# Altium schematic sheet Power_Supply_LV.SchDoc
size A4; CompanyName: Technische Hochschule Nürnberg Georg Simon Ohm; DrawnBy: T Gaupp; Address1: Fürther Straße 250; Address2: 90429 Nürnberg; Address3: GERMANY; SheetNumber: 3; SheetTotal: 6; CompanyName2: Institut ELSYS
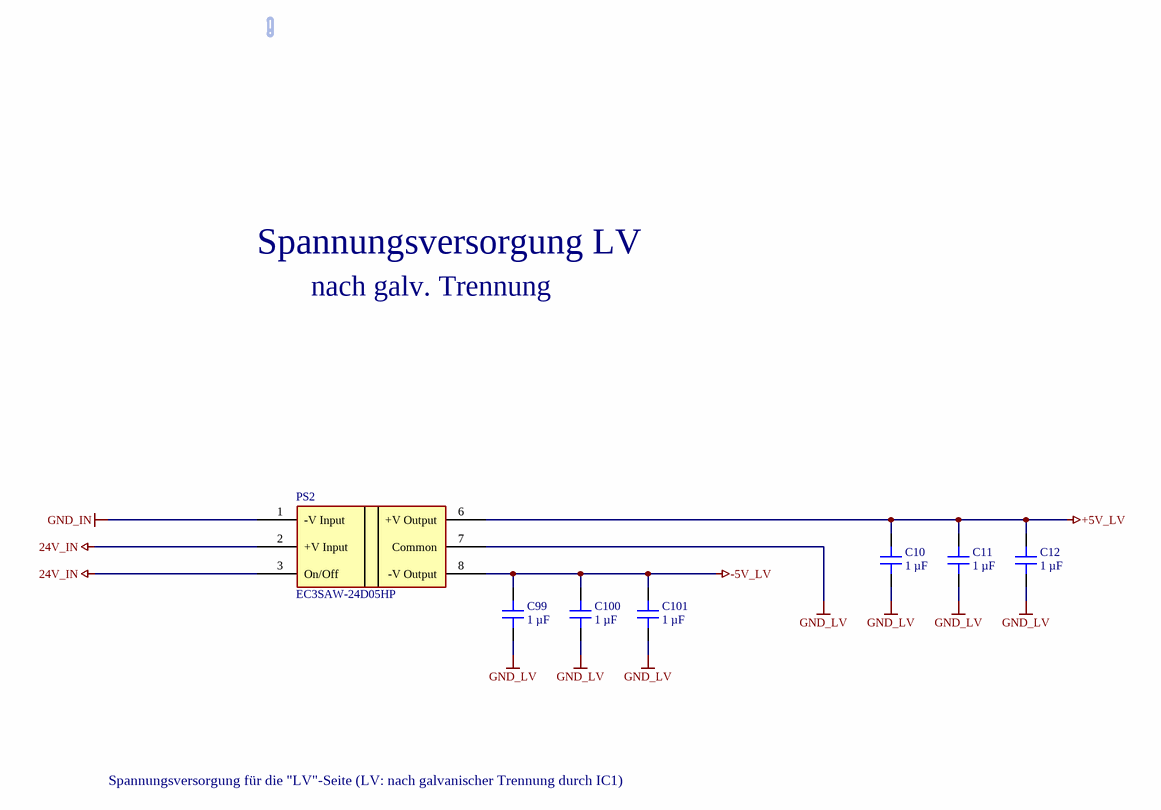
[diagram p0: Power_Supply_LV.SchDoc]

## Parts
C10  1 µF  [C_0603]
C11  1 µF  [C_0603]
C12  1 µF  [C_0603]
C99  1 µF  [C_0603]
C100  1 µF  [C_0603]
C101  1 µF  [C_0603]
PS2  EC3SAW-24D05HP  [EC3SAW]

## Nets
24V_IN: PS2.2(+V_Input) PS2.3(On/Off)
+5V_LV: C10.2 C11.2 C12.2 PS2.6(+V_Output)
-5V_LV: C99.2 C100.2 C101.2 PS2.8(-V_Output)
GND_IN: PS2.1(-V_Input)
GND_LV: C10.1 C11.1 C12.1 C99.1 C100.1 C101.1 PS2.7(Common)

## Notes on the sheet
- Spannungsversorgung LV
- nach galv. Trennung
- Spannungsversorgung für die "LV"-Seite (LV: nach galvanischer Trennung durch IC1)
- Title
- Size:
- Date:
- A4
- Revision:
- Time:
- Sheet
- of
- Author:
- Project:

## Library data of the parts
C10-C12 C99-C101 = CL10A105KB8NNNC: 50V 1uF X5R ±10% 0603  Multilayer Ceramic Capacitors MLCC - SMD/SMT ROHS; Manufacturer: Samsung Electro-Mechanics; Voltage Rating: 50 VDC; Created from: MGremer; Supplier 1: LCSC; Supplier Part Number 1: C15849; Manufacturer Part Number: CL10A105KB8NNNC; Value: 1 µF; PartID: 5; Created On: 20.12.2020 13:54:13; ComponentLink1Description: Datasheet; ComponentLink1URL: https://datasheet.lcsc.com/lcsc/1810261812_Samsung-Electro-Mechanics-CL10A105KB8NNNC_C15849.pdf; Component Type: Capacitor 0603; Device Package: 0603; Last Updated: 28.11.2022 17:23:01; Mounting Type: SMD; Operating Temperature: -55 - 85°C; Series: M; Type: Capacitor; Tolerance: 10 %; Live Cycle Status: 1; LCSC Part Number: C15849; Stock number: Labor SMD Container
PS2 = EC3SAW-24D05HP: Isolierte DC/DC-Wandler – Durchsteckmontage 3W 9-36Vin +/-5Vout 300mA; Manufacturer: Cincon; Supplier 1: Mouser; Supplier Part Number 1: 418-EC3SAW-24D05HP; Man Part Number: EC3SAW-24D05HP